# EAGLE schematic Edith (EAGLE 7.2.0)
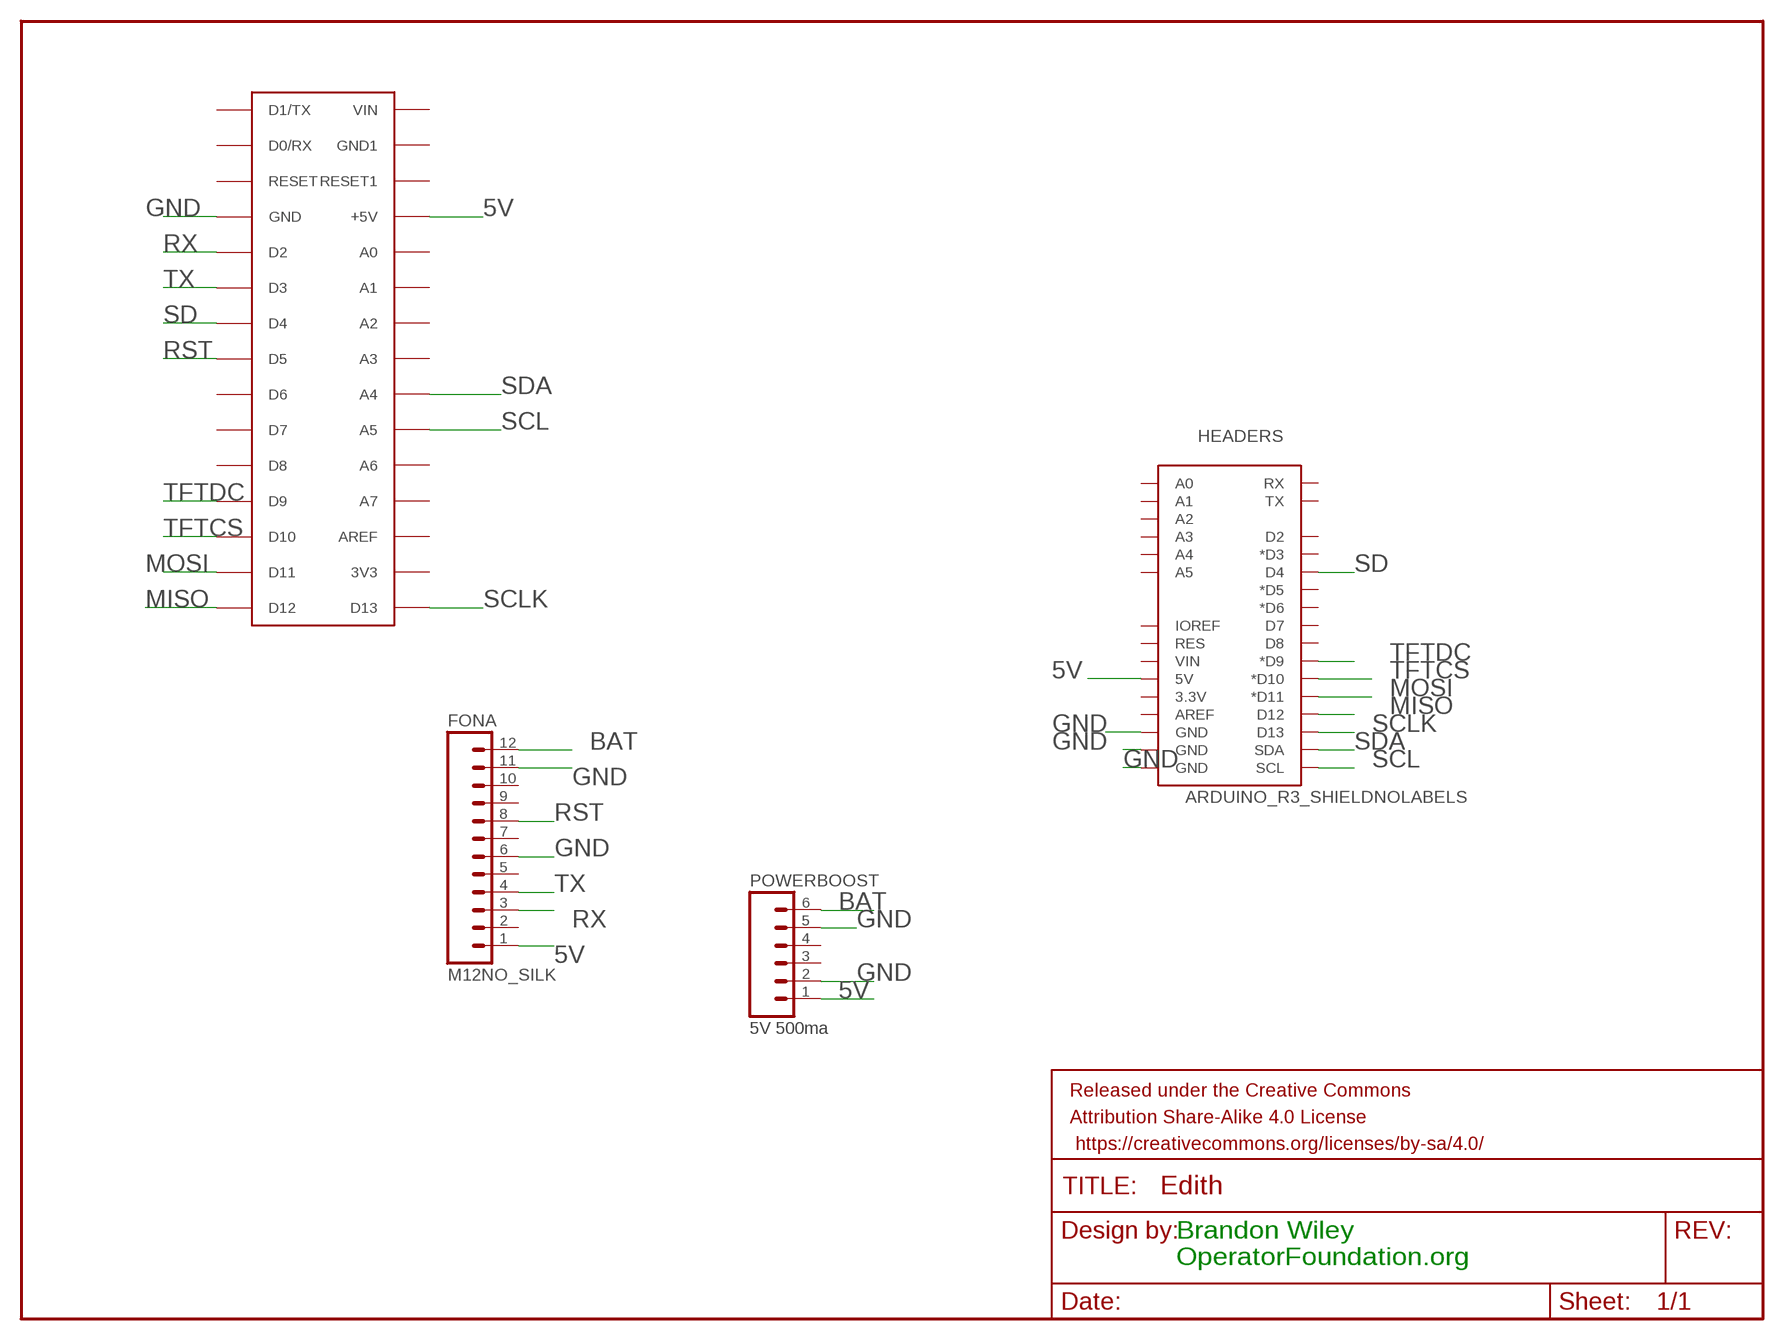
[diagram p0: schematic, sheet 1]

## Parts
FONA  M12NO_SILK  [1X12_NO_SILK]
FRAME1  FRAME-LETTER  [CREATIVE_COMMONS]
HEADERS  ARDUINO_R3_SHIELDNOLABELS  [UNO_R3_SHIELD_NOLABELS]
POWERBOOST  5V 500ma  M06NO_SILK  [1X06_NO_SILK]
U$1  ARDUINONANO  [PDIP-32]

## Nets
5V: FONA.1 HEADERS.5V POWERBOOST.1 U$1.+5V
BAT: FONA.12 POWERBOOST.6
GND: FONA.6 FONA.11 HEADERS.GND@0(GND) HEADERS.GND@1(GND) HEADERS.GND@2(GND) POWERBOOST.2 POWERBOOST.5 U$1.GND
MISO: HEADERS.D12 U$1.D12
MOSI: HEADERS.D11(*D11) U$1.D11
RST: FONA.8 U$1.D5
RX: FONA.3 U$1.D2
SCL: HEADERS.SCL U$1.A5
SCLK: HEADERS.D13 U$1.D13
SD: HEADERS.D4 U$1.D4
SDA: HEADERS.SDA U$1.A4
TFTCS: HEADERS.D10(*D10) U$1.D10
TFTDC: HEADERS.D9(*D9) U$1.D9
TX: FONA.4 U$1.D3
Unconnected: FONA.2 FONA.5 FONA.7 FONA.9 FONA.10 HEADERS.3.3V HEADERS.A0 HEADERS.A1 HEADERS.A2 HEADERS.A3 HEADERS.A4 HEADERS.A5 HEADERS.AREF HEADERS.D2 HEADERS.D3(*D3) HEADERS.D5(*D5) HEADERS.D6(*D6) HEADERS.D7 HEADERS.D8 HEADERS.IOREF HEADERS.RES HEADERS.RX HEADERS.TX HEADERS.VIN POWERBOOST.3 POWERBOOST.4 U$1.3V3 U$1.A0 U$1.A1 U$1.A2 U$1.A3 U$1.A6 U$1.A7 U$1.AREF U$1.D0/RX U$1.D1/TX U$1.D6 U$1.D7 U$1.D8 U$1.GND1 U$1.RESET U$1.RESET1 U$1.VIN

## Notes on the sheet
- Brandon Wiley
  OperatorFoundation.org

## Library data of the parts
FONA = SparkFun-Connectors:M12: Header 12 Standard 12-pin 0.1" header. Use with straight break away headers (SKU : PRT-00116), right angle break away headers (PRT-00553), swiss pins (PRT-00743), machine pins (PRT-00117), and female headers (PRT-00115).
FRAME1 = SparkFun-Aesthetics:FRAME-LETTER: Schematic Frame Standard 8.5x11 US Letter frame
HEADERS = SparkFun-Boards:ARDUINO_R3_SHIELD: Shield form compatible with the Arduino Uno R3.
POWERBOOST = SparkFun-Connectors:M06: Header 6 Standard 6-pin 0.1" header. Use with straight break away headers (SKU : PRT-00116), right angle break away headers (PRT-00553), swiss pins (PRT-00743), machine pins (PRT-00117), and female headers (PRT-00115). Molex polarized connector foot print use with SKU : PRT-08094 with associated crimp pins and housings. NOTES ON THE VARIANTS LOCK and LOCK_LONGPADS... This footprint was designed to help hold the alignment of a through-hole component (i.e. 6-pin header) while soldering it into place. You may notice that each hole has been shifted either up or down by 0.005 of an inch from it's more standard position (which is a perfectly straight line). This slight alteration caused the pins (the squares in the middle) to touch the edges of the holes. Because they are alternating, it causes a "brace" to hold the component in place. 0.005 has proven to be the perfect amount of "off-center" position when using our standard breakaway headers. Although looks a little odd when you look at the bare footprint, once you have a header in there, the alteration is very hard to notice. Also,if you push a header all the way into place, it is covered up entirely on the bottom side. This idea of altering the position of holes to aid alignment will be further integrated into the Sparkfun Library for other footprints. It can help hold any component with 3 or more connection pins.
U$1 = jet-lib:ARDUINONANO